# EAGLE design pc_heartypatch_v2.1 (EAGLE 6.6.0)

## Sheet 1 of 2
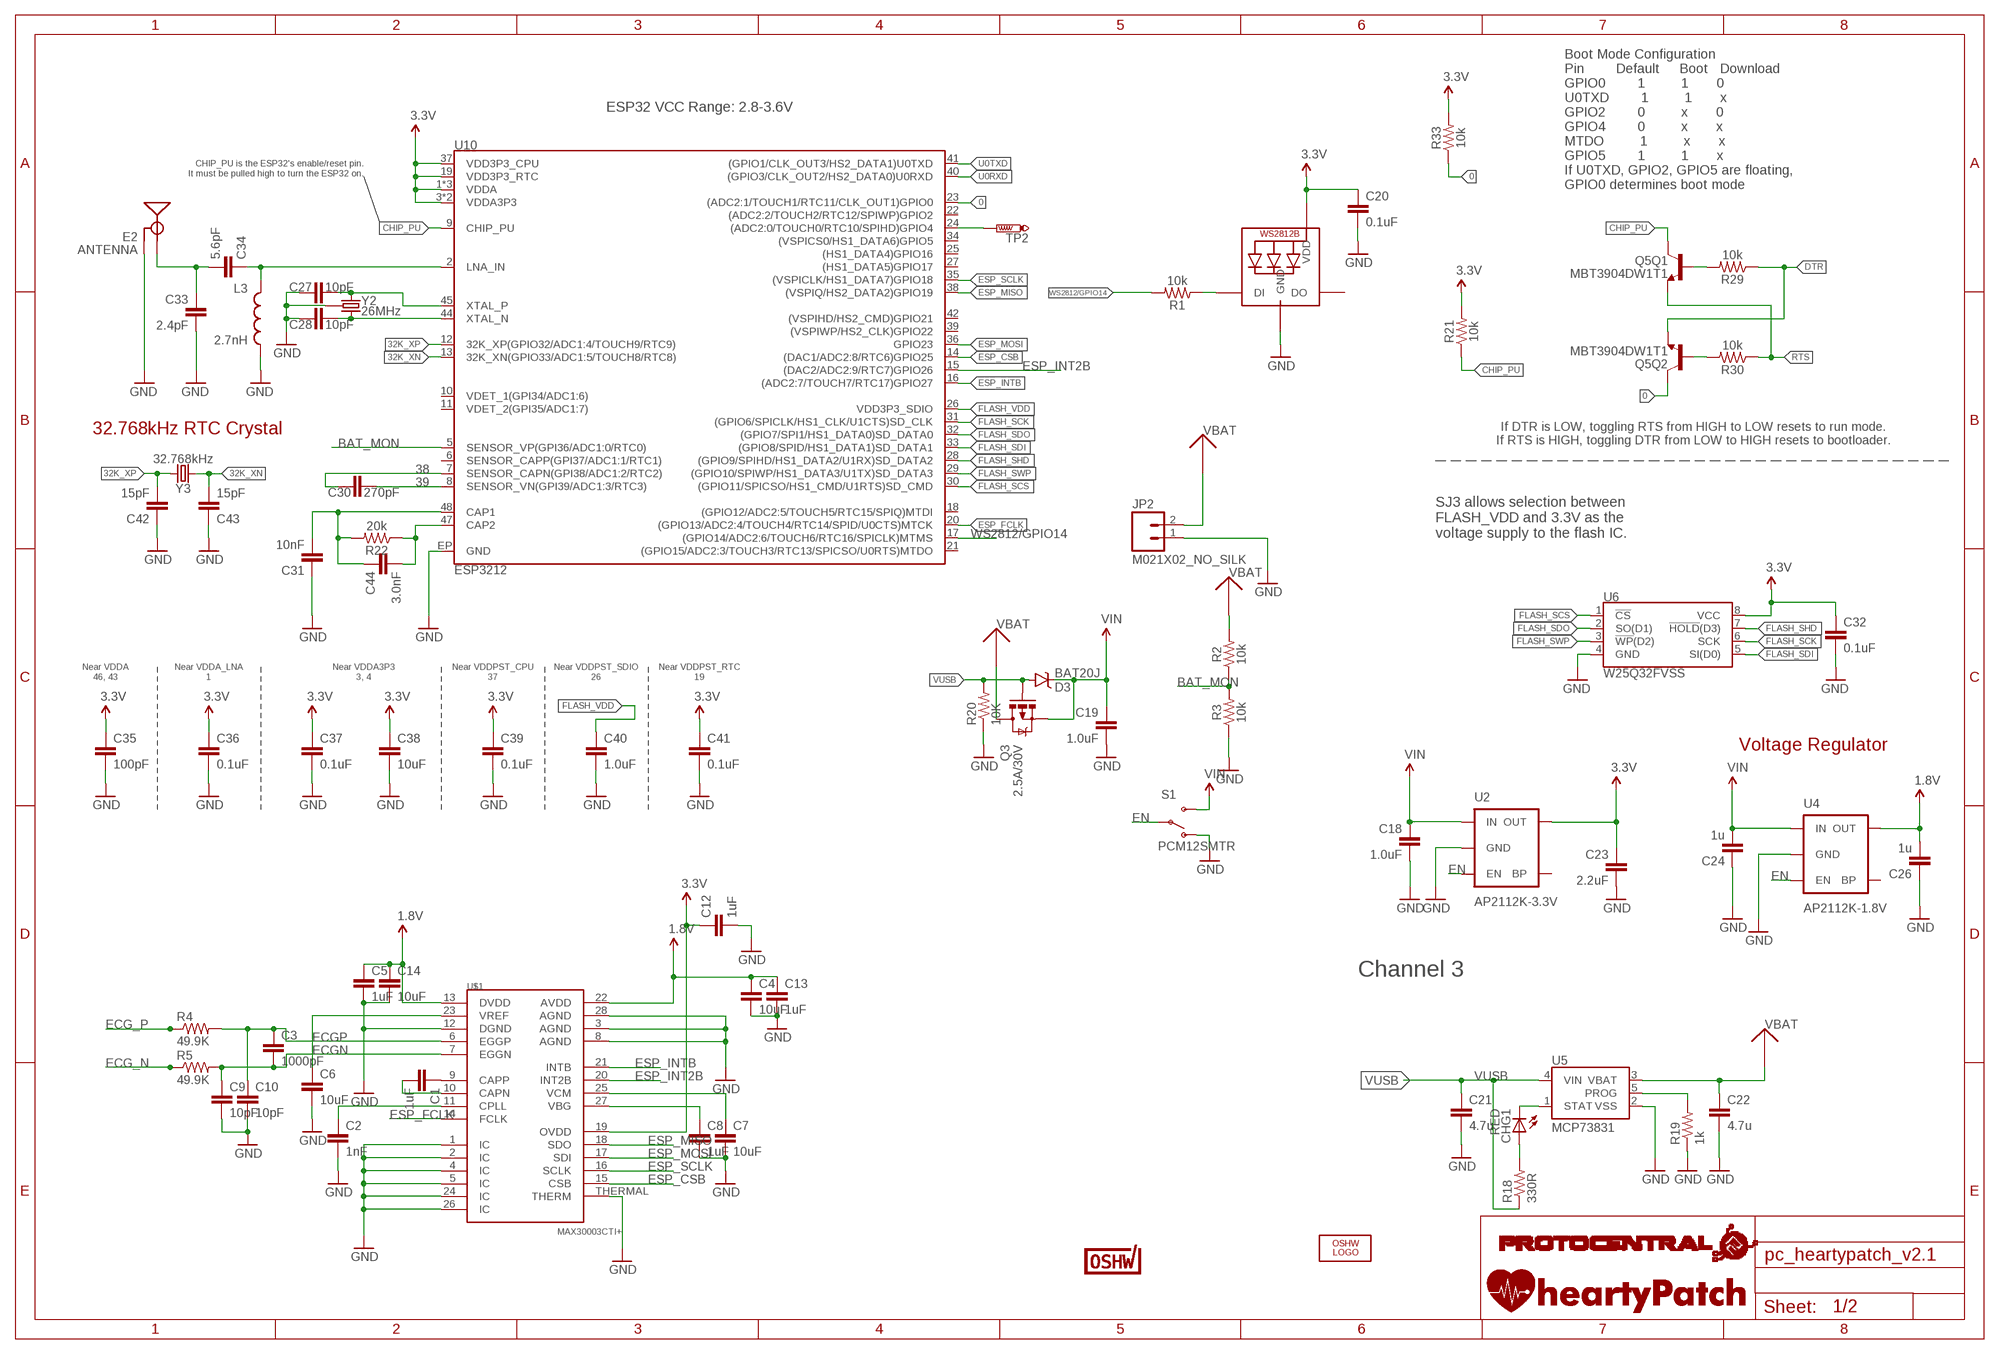
[diagram p0: schematic, sheet 1]

### Parts
C1  1uF  C-EUC0603  [C0603]
C2  1nF  C-EUC0603  [C0603]
C3  1000pF  C-EUC0402  [C0402]
C4  10uF  C-EUC0805  [C0805]
C5  1uF  C-EUC0402  [C0402]
C6  10uF  C-EUC0805  [C0805]
C7  10uF  C-EUC0805  [C0805]
C8  1uF  C-EUC0402  [C0402]
C9  10pF  C-EUC0402  [C0402]
C10  10pF  C-EUC0402  [C0402]
C12  1uF  C-EUC0402  [C0402]
C13  1uF  C-EUC0402  [C0402]
C14  10uF  C-EUC0603  [C0603]
C18  1.0uF  1.0UF-25V-+80/-20(0805)  [0805]
C19  1.0uF  C-EUC0402  [C0402]
C20  0.1uF  0.1UF-0603-25V-(+80/-20%)  [0603]
C21  4.7u  C-EUC0805  [C0805]
C22  4.7u  C-EUC0805  [C0805]
C23  2.2uF  C-EUC0805  [C0805]
C24  1u  C-EUC0805  [C0805]
C26  1u  C-EUC0805  [C0805]
C27  10pF  10PF-0603-50V-5%  [0603]
C28  10pF  10PF-0603-50V-5%  [0603]
C30  270pF  270PF-50V-5%(0603)  [0603]
C31  10nF  10NF-0603-50V-10%  [0603]
C32  0.1uF  0.1UF-0402-16V-10%  [0402]
C33  2.4pF  2.4PF-0603-50V-5%  [0603]
C34  5.6pF  5.6PF-50V-5%(0603)  [0603]
C35  100pF  100PF-0603-50V-5%  [0603]
C36  0.1uF  0.1UF-0603-25V-(+80/-20%)  [0603]
C37  0.1uF  0.1UF-0603-25V-(+80/-20%)  [0603]
C38  10uF  10UF-0603-6.3V-20%  [0603]
C39  0.1uF  0.1UF-0402-16V-10%  [0402]
C40  1.0uF  1.0UF-0603-16V-10%  [0603]
C41  0.1uF  0.1UF-0603-25V-(+80/-20%)  [0603]
C42  15pF  15PF-0603-50V-5%  [0603]
C43  15pF  15PF-0603-50V-5%  [0603]
C44  3.0nF  3.0NF-0603-50V-5%  [0603]
CHG1  RED  LEDCHIPLED_0603  [CHIPLED_0603]
D3  BAT20J  DIODE-SCHOTTKY-BAT20J  [SOD-323]
E2  ANTENNA  ANTENNATRACE-TUNED  [TRACE_ANTENNA_2.4GHZ_25.7MM_TUNED]
JP2  M021X02_NO_SILK  [1X02_NO_SILK]
L3  2.7nH  INDUCTOR0603  [0603]
LED1  WS2812B5050  [WS2812B]
LOGO1  OSHW_LOGO_FILLX0200-NT  [OSHW_FILLX200_NOTEXT]
Q3  2.5A/30V  MOSFET-PCHANNELDMG2307L  [SOT23-3]
Q5  MBT3904DW1T1  [SC70-6]
R1  10k  10KOHM-1/10W-1%(0603)0603  [0603]
R2  10k  10KOHM-1/10W-1%(0603)0603  [0603]
R3  10k  10KOHM-1/10W-1%(0603)0603  [0603]
R4  49.9K  RESISTOR0805-RES  [0805]
R5  49.9K  RESISTOR0805-RES  [0805]
R18  330R  R-US_R0402  [R0402]
R19  1k  R-US_R0402  [R0402]
R20  10K  R-US_R0402  [R0402]
R21  10k  10KOHM-1/10W-1%(0603)0603  [0603]
R22  20k  20KOHM-0603-1/10W-1%  [0603]
R29  10k  10KOHM-0603-1/10W-1%  [0603]
R30  10k  10KOHM-0603-1/10W-1%  [0603]
R33  10k  10KOHM-1/10W-1%(0603)0603  [0603]
S1  PCM12SMTR  SWITCH-SPDT-SMD-A  [SWITCH-SPST-SMD-A]
TP2  PTR1TP10SQ  [TP10SQ]
U2  AP2112K-3.3V  V_REG_LDOSMD  [SOT23-5]
U4  AP2112K-1.8V  V_REG_LDOSMD  [SOT23-5]
U5  MCP73831  [SOT23-5]
U6  W25Q32FVSS  [SOIC-8]
U10  ESP3212  [QFN48-0.4MM]
U$1  MAX30003CTI+  MAX30003  [QFN-28]
U$8  HEARTYPATCHHEART  [HEARTYPATCH]
U$9  PROTY_LOGO_WITH_TEXT  [PROTY_WITH_TEXT]
U$10  CERT-SMALL  [CERT-SMALL-SILK]
Y2  26MHz  CRYSTAL-GROUNDED3.2X2.5  [CRYSTAL-SMD-3.2X2.5]
Y3  32.768kHz  CRYSTAL-32.768KHZSMD-3.2X1.5  [CRYSTAL-SMD-3.2X1.5MM]

### Nets
0: Q5.6(Q2:C) R33.1 U10.23((ADC2:1/TOUCH1/RTC11/CLK_OUT1)GPIO0)
1.8V: C4.1 C5.1 C13.1 C14.1 C26.2 U4.5(OUT) U$1.13(DVDD) U$1.22(AVDD)
3.3V: C12.1 C20.1 C23.1 C32.1 C35.1 C36.1 C37.1 C38.1 C39.1 C41.1 LED1.1-VDD(VDD) R21.2 R33.2 U2.5(OUT) U6.8(VCC) U10.1(VDDA) U10.3(VDDA3P3) U10.4(VDDA3P3) U10.19(VDD3P3_RTC) U10.37(VDD3P3_CPU) U10.43(VDDA) U10.46(VDDA) U$1.19(OVDD)
32K_XN: C43.2 U10.13(32K_XN(GPIO33/ADC1:5/TOUCH8/RTC8)) Y3.P$2
32K_XP: C42.2 U10.12(32K_XP(GPIO32/ADC1:4/TOUCH9/RTC9)) Y3.P$1
38: C30.1 U10.7(SENSOR_CAPN(GPI38/ADC1:2/RTC2))
39: C30.2 U10.8(SENSOR_VN(GPI39/ADC1:3/RTC3))
BAT_MON: R2.1 R3.2 U10.5(SENSOR_VP(GPI36/ADC1:0/RTC0))
CAP_10N: C31.2 C44.1 R22.2 U10.48(CAP1)
CHIP_PU: Q5.3(Q1:C) R21.1 U10.9(CHIP_PU)
DTR: Q5.1(Q2:E) R29.1 ; also sheet 2
ECG_N: R5.1
ECG_P: R4.1
ECGN: C3.2 C9.1 R5.2 U$1.7(EGGN)
ECGP: C3.1 C10.1 R4.2 U$1.6(EGGP)
EN: S1.2(P) U2.3(EN) U4.3(EN)
ESP_CSB: U10.14((DAC1/ADC2:8/RTC6)GPIO25) U$1.15(CSB)
ESP_FCLK: U10.20((GPIO13/ADC2:4/TOUCH4/RTC14/SPID/U0CTS)MTCK) U$1.14(FCLK)
ESP_INT2B: U10.15((DAC2/ADC2:9/RTC7)GPIO26) U$1.20(INT2B)
ESP_INTB: U10.16((ADC2:7/TOUCH7/RTC17)GPIO27) U$1.21(INTB)
ESP_MISO: U10.38((VSPIQ/HS2_DATA2)GPIO19) U$1.18(SDO)
ESP_MOSI: U10.36(GPIO23) U$1.17(SDI)
ESP_SCLK: U10.35((VSPICLK/HS1_DATA7)GPIO18) U$1.16(SCLK)
FLASH_SCK: U6.6(SCK) U10.31((GPIO6/SPICLK/HS1_CLK/U1CTS)SD_CLK)
FLASH_SCS: U6.1(!CS!) U10.30((GPIO11/SPICSO/HS1_CMD/U1RTS)SD_CMD)
FLASH_SDI: U6.5(SI(D0)) U10.33((GPIO8/SPID/HS1_DATA1)SD_DATA1)
FLASH_SDO: U6.2(SO(D1)) U10.32((GPIO7/SPI1/HS1_DATA0)SD_DATA0)
FLASH_SHD: U6.7(!HOLD!(D3)) U10.28((GPIO9/SPIHD/HS1_DATA2/U1RX)SD_DATA2)
FLASH_SWP: U6.3(!WP!(D2)) U10.29((GPIO10/SPIWP/HS1_DATA3/U1TX)SD_DATA3)
FLASH_VDD: C40.1 U10.26(VDD3P3_SDIO)
GND: C2.2 C4.2 C5.2 C6.2 C7.2 C8.2 C9.2 C10.2 C12.2 C13.2 C14.2 C18.2 C19.2 C20.2 C21.2 C22.2 C23.2 C24.1 C26.1 C27.1 C28.1 C31.1 C32.2 C33.2 C35.2 C36.2 C37.2 C38.2 C39.2 C40.2 C41.2 C42.1 C43.1 E2.GND E2.GND2(GND) JP2.1 L3.2 LED1.3-GND(GND) R3.1 R19.1 R20.1 S1.1(O) U2.2(GND) U4.2(GND) U5.2(VSS) U6.4(GND) U10.EP(GND) U$1.1(IC) U$1.2(IC) U$1.3(AGND) U$1.4(IC) U$1.5(IC) U$1.8(AGND) U$1.12(DGND) U$1.24(IC) U$1.26(IC) U$1.28(AGND) U$1.THERMAL(THERM) Y2.2(GND) Y2.4(GND) ; also sheet 2
LNA_IN: C34.1 L3.1 U10.2(LNA_IN)
N$1: LED1.4-DIN(DI) R1.1
N$2: C6.1 U$1.23(VREF)
N$3: C1.1 U$1.9(CAPP)
N$4: TP2.TP U10.24((ADC2:0/TOUCH0/RTC10/SPIHD)GPIO4)
N$5: CHG1.C U5.1(STAT)
N$6: C1.2 U$1.10(CAPN)
N$7: C2.1 U$1.11(CPLL)
N$13: C7.1 U$1.25(VCM)
N$14: C8.1 U$1.27(VBG)
N$16: CHG1.A R18.2
N$19: R19.2 U5.5(PROG)
N$23: Q5.5(Q1:B) R29.2
N$24: Q5.2(Q2:B) R30.2
N$25: C27.2 U10.45(XTAL_P) Y2.1
N$26: C28.2 U10.44(XTAL_N) Y2.3
N$30: C44.2 R22.1 U10.47(CAP2)
RTS: Q5.4(Q1:E) R30.1 ; also sheet 2
TRACE_ANT1: C33.1 C34.2 E2.ANT(SIGNAL)
U0RXD: U10.40((GPIO3/CLK_OUT2/HS2_DATA0)U0RXD) ; also sheet 2
U0TXD: U10.41((GPIO1/CLK_OUT3/HS2_DATA1)U0TXD) ; also sheet 2
VBAT: C22.1 JP2.2 Q3.3(D) R2.2 U5.3(VBAT)
VIN: C18.1 C19.1 C24.2 D3.C Q3.2(S) S1.3(S) U2.1(IN) U4.1(IN)
VUSB: C21.1 D3.A Q3.1(G) R18.1 R20.2 U5.4(VIN) ; also sheet 2
WS2812/GPIO14: R1.2 U10.17((GPIO14/ADC2:6/TOUCH6/RTC16/SPICLK)MTMS)
Unconnected: LED1.2-DOUT(DO) U2.4(BP) U4.4(BP) U10.6(SENSOR_CAPP(GPI37/ADC1:1/RTC1)) U10.10(VDET_1(GPI34/ADC1:6)) U10.11(VDET_2(GPI35/ADC1:7)) U10.18((GPIO12/ADC2:5/TOUCH5/RTC15/SPIQ)MTDI) U10.21((GPIO15/ADC2:3/TOUCH3/RTC13/SPICSO/U0RTS)MTDO) U10.22((ADC2:2/TOUCH2/RTC12/SPIWP)GPIO2) U10.25((HS1_DATA4)GPIO16) U10.27((HS1_DATA5)GPIO17) U10.34((VSPICS0/HS1_DATA6)GPIO5) U10.39((VSPIWP/HS2_CLK)GPIO22) U10.42((VSPIHD/HS2_CMD)GPIO21)

### Notes on the sheet
- ESP32 VCC Range: 2.8-3.6V
- CHIP_PU is the ESP32's enable/reset pin.
  It must be pulled high to turn the ESP32 on.
- Boot Mode Configuration
  Pin        Default     Boot   Download
  GPIO0        1         1       0
  U0TXD        1         1       x
  GPIO2        0         x       0
  GPIO4        0         x       x
  MTDO         1         x       x
  GPIO5        1         1       x
  If U0TXD, GPIO2, GPIO5 are floating, 
  GPIO0 determines boot mode
- 32.768kHz RTC Crystal
- If DTR is LOW, toggling RTS from HIGH to LOW resets to run mode.
  If RTS is HIGH, toggling DTR from LOW to HIGH resets to bootloader.
- SJ3 allows selection between 
  FLASH_VDD and 3.3V as the
  voltage supply to the flash IC.
- Near VDDA
  46, 43
- Near VDDA_LNA
  1
- Near VDDA3P3
  3, 4
- Near VDDPST_CPU
  37
- Near VDDPST_SDIO
  26
- Near VDDPST_RTC
  19
- Voltage Regulator
- Channel 3

## Sheet 2 of 2
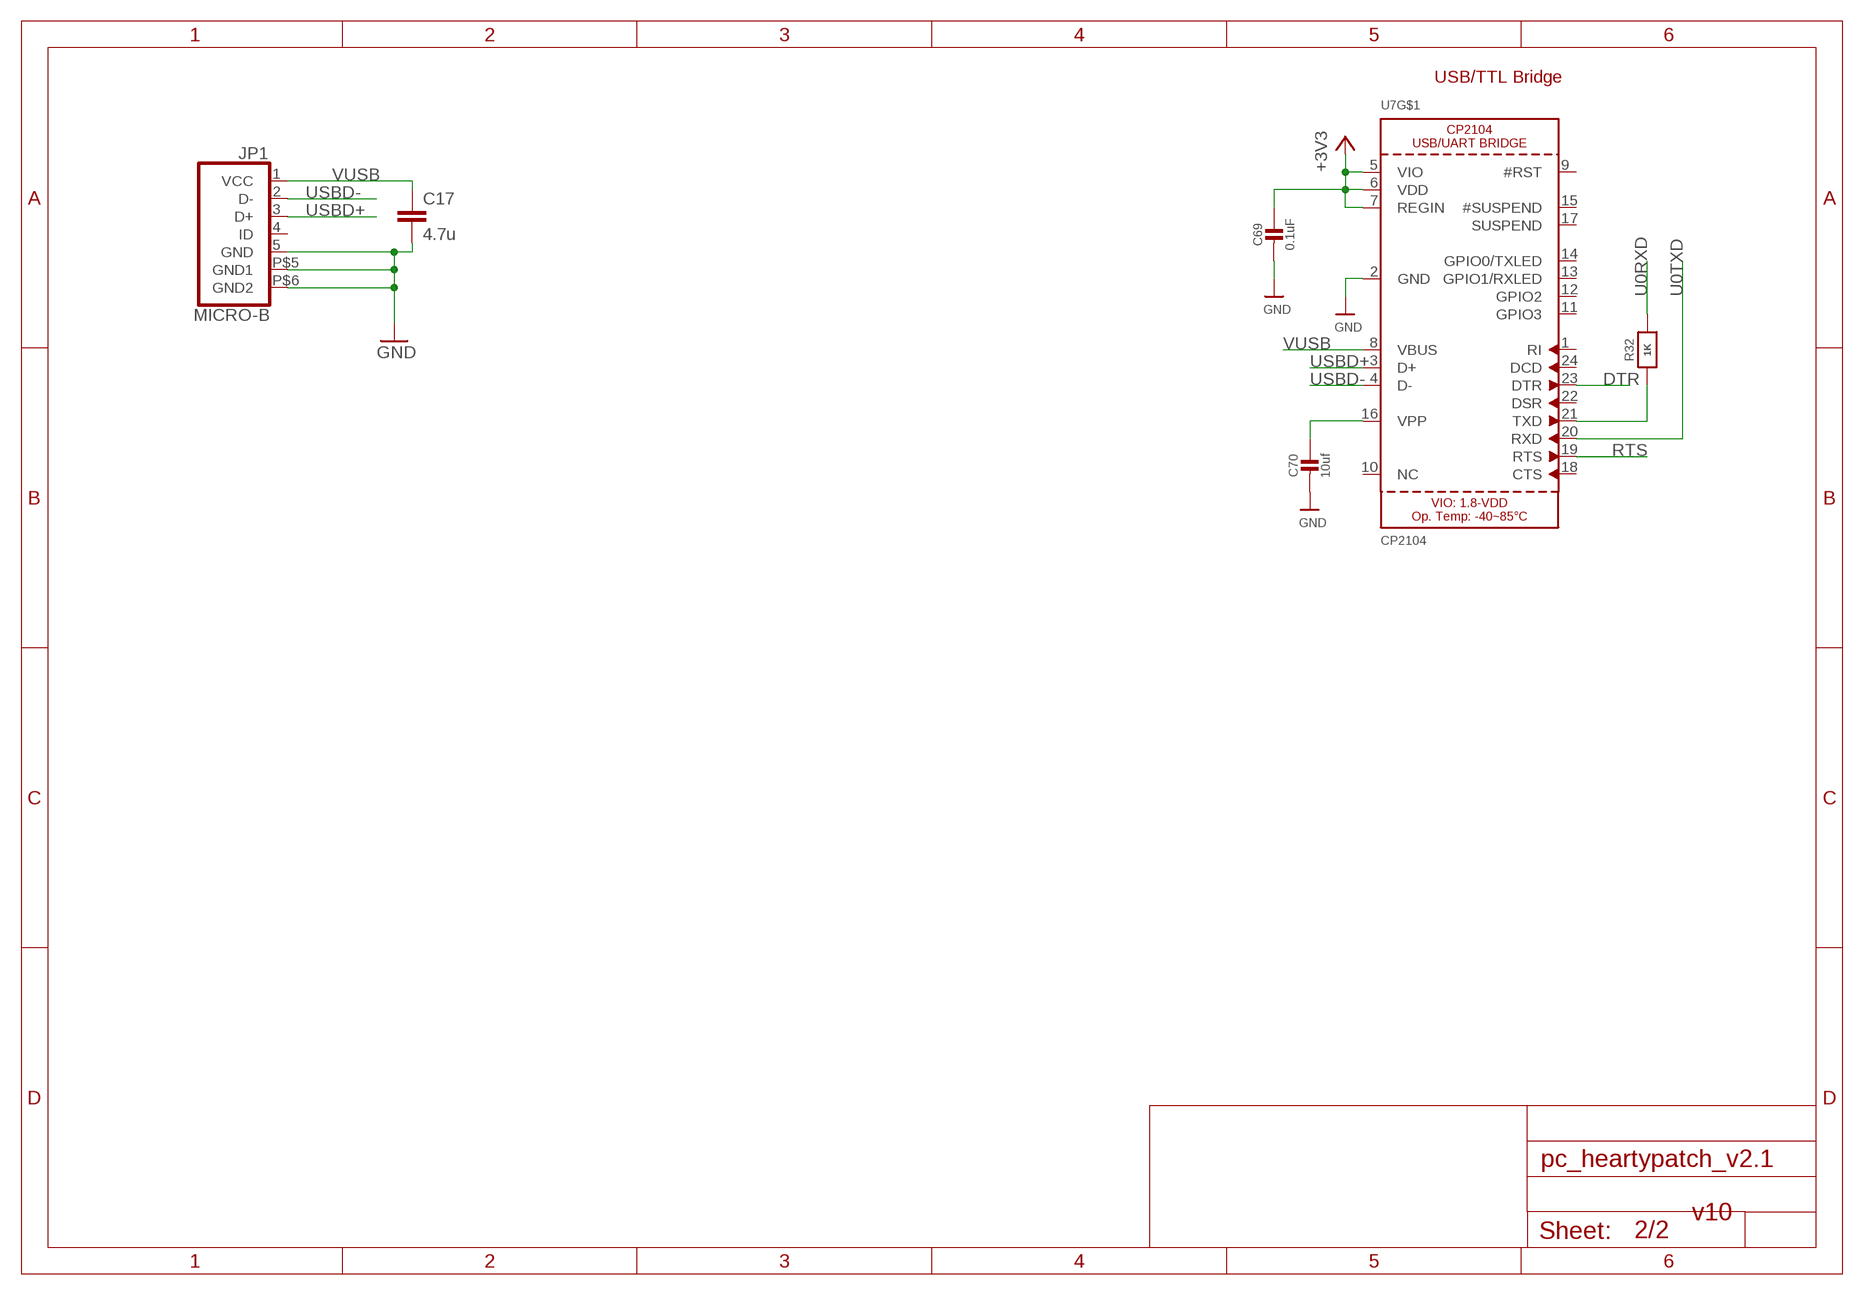
[diagram p1: schematic, sheet 2]

### Parts
C17  4.7u  C-EUC0805  [C0805]
C69  0.1uF  CAP_CERAMIC_0402  [_0402]
C70  10uf  CAP_CERAMIC0805-NOOUTLINE  [0805-NO]
JP1  MICRO-B  [MICRO-B]
R32  1K  RESISTOR_0603_NOOUT  [0603-NO]
U7  CP2104  [QFN24_4MM_SMSC]

### Nets
+3V3: C69.1 U7.5(VIO) U7.6(VDD) U7.7(REGIN)
DTR: U7.23(DTR) ; also sheet 1
GND: C17.2 C69.2 C70.2 JP1.5(GND) JP1.P$5(GND1) JP1.P$6(GND2) U7.2(GND) ; also sheet 1
N$27: R32.1 U7.21(TXD)
N$28: C70.1 U7.16(VPP)
RTS: U7.19(RTS) ; also sheet 1
U0RXD: R32.2 ; also sheet 1
U0TXD: U7.20(RXD) ; also sheet 1
USBD+: JP1.3(D+) U7.3(D+)
USBD-: JP1.2(D-) U7.4(D-)
VUSB: C17.1 JP1.1(VCC) U7.8(VBUS) ; also sheet 1
Unconnected: JP1.4(ID) U7.1(RI) U7.9(#RST) U7.10(NC) U7.11(GPIO3) U7.12(GPIO2) U7.13(GPIO1/RXLED) U7.14(GPIO0/TXLED) U7.15(#SUSPEND) U7.17(SUSPEND) U7.18(CTS) U7.22(DSR) U7.24(DCD)

### Notes on the sheet
- USB/TTL Bridge
- v10

## Power pins joined to a net without a drawn wire
TP: U7.THERM(TP)

## Library data of the parts
C1-C10 C12-C14 C17 C19 C21-C24 C26 = rcl:C-EU: CAPACITOR, European symbol
C18 = SparkFun-Capacitors:1.0UF-25V-+80/-20(0805): CAP-11625; PROD_ID: CAP-11625
C20 C36 C37 C41 = SparkFun-Capacitors:0.1UF: 0.1µF ceramic capacitors A capacitor is a passive two-terminal electrical component used to store electrical energy temporarily in an electric field.; PROD_ID: CAP-00810
C27 C28 = SparkFun-Capacitors:10PF: 10pF ceramic capacitors A capacitor is a passive two-terminal electrical component used to store electrical energy temporarily in an electric field.; PROD_ID: CAP-11812
C30 = esp32-thing-temp:270PF-50V-5%(0603): CAP-13339; PROD_ID: CAP-13339
C31 = SparkFun-Capacitors:10NF: 0.01uF/10nF/10,000pF ceramic capacitors A capacitor is a passive two-terminal electrical component used to store electrical energy temporarily in an electric field. CAP-09321; PROD_ID: CAP-00867
C32 C39 = SparkFun-Capacitors:0.1UF: 0.1µF ceramic capacitors A capacitor is a passive two-terminal electrical component used to store electrical energy temporarily in an electric field.; PROD_ID: CAP-12416
C33 = esp32-thing-temp:2.4PF: 2.4pF ceramic capacitors A capacitor is a passive two-terminal electrical component used to store electrical energy temporarily in an electric field.; PROD_ID: CAP-13541
C34 = esp32-thing-temp:5.6PF-50V-5%(0603): CAP-12456; PROD_ID: CAP-12456
C35 = SparkFun-Capacitors:100PF: 100pF/0.1nF ceramic capacitors A capacitor is a passive two-terminal electrical component used to store electrical energy temporarily in an electric field.; PROD_ID: CAP-07883
C38 = SparkFun-Capacitors:10UF: 10.0µF ceramic capacitors A capacitor is a passive two-terminal electrical component used to store electrical energy temporarily in an electric field.; PROD_ID: CAP-11015
C40 = SparkFun-Capacitors:1.0UF: 1µF ceramic capacitors A capacitor is a passive two-terminal electrical component used to store electrical energy temporarily in an electric field.; PROD_ID: CAP-00868
C42 C43 = SparkFun-Capacitors:15PF: 15pF ceramic capacitors A capacitor is a passive two-terminal electrical component used to store electrical energy temporarily in an electric field.; PROD_ID: CAP-07881
C44 = esp32-thing-temp:3.0NF: 3.0nF (3nF, 3000pF) ceramic capacitors A capacitor is a passive two-terminal electrical component used to store electrical energy temporarily in an electric field.; PROD_ID: CAP-13515
C69 C70 = microbuilder:CAP_CERAMIC: Ceramic Capacitors For new designs, use the packages preceded by an '_' character since they are more reliable: The following footprints should be used on most boards: _0402 - Standard footprint for regular board layouts _0603 - Standard footprint for regular board layouts _0805 - Standard footprint for regular board layouts _1206 - Standard footprint for regular board layouts For extremely tight-pitch boards where space is at a premium, the following 'micro-pitch' footprints can be used (smaller pads, no silkscreen outline, etc.): _0402MP - Micro-pitch footprint for very dense/compact boards _0603MP - Micro-pitch footprint for very dense/compact boards _0805MP - Micro-pitch footprint for very dense/compact boards _1206MP - Micro-pitch footprint for very dense/compact boards
CHG1 = led:LED: LED OSRAM: - CHIPLED LG R971, LG N971, LY N971, LG Q971, LY Q971, LO R971, LY R971 LH N974, LH R974 LS Q976, LO Q976, LY Q976 LO Q996 - Hyper CHIPLED LW Q18S LB Q993, LB Q99A, LB R99A - SideLED LS A670, LO A670, LY A670, LG A670, LP A670 LB A673, LV A673, LT A673, LW A673 LH A674 LY A675 LS A676, LA A676, LO A676, LY A676, LW A676 LS A679, LY A679, LG A679 - Hyper Micro SIDELED® LS Y876, LA Y876, LO Y876, LY Y876 LT Y87S - SmartLED LW L88C, LW L88S LB L89C, LB L89S, LG L890 LS L89K, LO L89K, LY L89K LS L896, LA L896, LO L896, LY L896 - TOPLED LS T670, LO T670, LY T670, LG T670, LP T670 LSG T670, LSP T670, LSY T670, LOP T670, LYG T670 LG T671, LOG T671, LSG T671 LB T673, LV T673, LT T673, LW T673 LH T674 LS T676, LA T676, LO T676, LY T676, LB T676, LH T676, LSB T676, LW T676 LB T67C, LV T67C, LT T67C, LS T67K, LO T67K, LY T67K, LW E67C LS E67B, LA E67B, LO E67B, LY E67B, LB E67C, LV E67C, LT E67C LW T67C LS T679, LY T679, LG T679 LS T770, LO T770, LY T770, LG T770, LP T770 LB T773, LV T773, LT T773, LW T773 LH T774 LS E675, LA E675, LY E675, LS T675 LS T776, LA T776, LO T776, LY T776, LB T776 LHGB T686 LT T68C, LB T68C - Hyper Mini TOPLED® LB M676 - Mini TOPLED Santana® LG M470 LS M47K, LO M47K, LY M47K Source: http://www.osram.convergy.de LUXEON: - LUMILED® LXK2-PW12-R00, LXK2-PW12-S00, LXK2-PW14-U00, LXK2-PW14-V00 LXK2-PM12-R00, LXK2-PM12-S00, LXK2-PM14-U00 LXK2-PE12-Q00, LXK2-PE12-R00, LXK2-PE12-S00, LXK2-PE14-T00, LXK2-PE14-U00 LXK2-PB12-K00, LXK2-PB12-L00, LXK2-PB12-M00, LXK2-PB14-N00, LXK2-PB14-P00, LXK2-PB14-Q00 LXK2-PR12-L00, LXK2-PR12-M00, LXK2-PR14-Q00, LXK2-PR14-R00 LXK2-PD12-Q00, LXK2-PD12-R00, LXK2-PD12-S00 LXK2-PH12-R00, LXK2-PH12-S00 LXK2-PL12-P00, LXK2-PL12-Q00, LXK2-PL12-R00 Source: www.luxeon.com KINGBRIGHT: KA-3528ASYC Source: www.kingbright.com
D3 = SparkFun-DiscreteSemi:DIODE-SCHOTTKY: Schottky diodes in SFE's production catalog BAT20J 1A 23V 0.62Vf RB751 120mA 40V 0.37Vf PMEG4005EJ 0.5A 40V 0.42Vf MBRA140 1A 40V 0.5Vf B340A 3A 40V SMA; PROD_ID: DIO-11623
E2 = esp32-thing-temp:ANTENNA: Chip antenna Chip antenna with ground or secondary connection. Common with larger metal RF connectors.
JP1 = circuitects:MICRO-B
JP2 = SparkFun-Connectors:M02: Standard 2-pin 0.1" header. Use with - straight break away headers ( PRT-00116) - right angle break away headers (PRT-00553) - swiss pins (PRT-00743) - machine pins (PRT-00117) - female headers (PRT-00115) Molex polarized connector foot print use with: PRT-08233 with associated crimp pins and housings. 2.54_SCREWTERM for use with PRT-10571. 3.5mm Screw Terminal footprints for PRT-08084 5mm Screw Terminal footprints for use with PRT-08433
L3 = SparkFun-Passives:INDUCTOR: Inductors Basic Inductor/Choke - 0603 and 1206. Footprints are not proven and vary greatly between part numbers. INDUCTOR POWER 3.3UH 4.0A SMD 0.197" L x 0.197" W x 0.177" H (5.00mm x 5.00mm x 4.50mm); PROD_ID: NDUC-08762
LED1 = adafruit:WS2812B
LOGO1 = ohw-logo:OSHW_LOGO_FILL
Q3 = SparkFun-DiscreteSemi:MOSFET-PCHANNEL: Generic PMOSFET IRLML2244 - TRANS-11153 (SOT-23 -20V -4.3A) (1.Gate 2.Source 3.Drain) FQP27P06 - COM-10349 <http://www.sparkfun.com/products/10349> (TO-220 -60V -27A) (1.Gate 2.Source 3.Drain); PROD_ID: TRANS-11308
Q5 = esp32-thing-temp:MBT3904DW1T1: MBT3904DW1 Dual NPN Transistors The MBT3904W1 puts two general purpose 3904 NPN transistors in a single package. Datasheet <http://www.onsemi.com/pub_link/Collateral/MBT3904DW1T1-D.PDF>; PROD_ID: TRANS-13337
R1-R3 R21 R33 = SparkFun-Resistors:10KOHM-1/10W-1%(0603): RES-00824; PROD_ID: RES-00824; VALUE: 10K
R4 R5 = SparkFun:RESISTOR: Resistor Basic schematic elements and footprints for 0603, 1206, and PTH resistors.
R18-R20 = rcl:R-US_: RESISTOR, American symbol
R22 = SparkFun-Resistors:20KOHM: 20kΩ resistor A resistor is a passive two-terminal electrical component that implements electrical resistance as a circuit element. Resistors act to reduce current flow, and, at the same time, act to lower voltage levels within circuits. - Wikipedia; PROD_ID: RES-09383
R29 R30 = SparkFun-Resistors:10KOHM: 10kΩ resistor A resistor is a passive two-terminal electrical component that implements electrical resistance as a circuit element. Resistors act to reduce current flow, and, at the same time, act to lower voltage levels within circuits. - Wikipedia; PROD_ID: RES-00824
R32 = microbuilder:RESISTOR: Resistors For new designs, use the packages preceded by an '_' character since they are more reliable: The following footprints should be used on most boards: _0402 - Standard footprint for regular board layouts _0603 - Standard footprint for regular board layouts _0805 - Standard footprint for regular board layouts _1206 - Standard footprint for regular board layouts For extremely tight-pitch boards where space is at a premium, the following 'micro-pitch' footprints can be used (smaller pads, no silkscreen outline, etc.): _0402MP - Micro-pitch footprint for very dense/compact boards _0603MP - Micro-pitch footprint for very dense/compact boards _0805MP - Micro-pitch footprint for very dense/compact boards _1206MP - Micro-pitch footprint for very dense/compact boards
S1 = SparkFun-Electromechanical:SWITCH-SPDT: SPDT Switch Simple slide switch, Spark Fun Electronics SKU : COM-00102 DPDT SMT slide switch, AYZ0202, SWCH-08179; PROD_ID: SWCH-10651
TP2 = testpad:PTR1: TEST PIN
U2 U4 = SparkFun-PowerIC:V_REG_LDO: Voltage Regulator LDO Standard 150mA LDO voltage regulator in SOT-23 layout. Micrel part MIC5205. BP (by-pass) pin is used to lower output noise with 470pF cap.; PROD_ID: VREG-12457
U5 = SparkFun:MCP73831: Microchip's MCP73831 Miniature single cell, fully integrated Li-Ion, Li-polymer charge management controller http://ww1.microchip.com/downloads/en/DeviceDoc/21984a.pdf
U6 = SparkFun-DigitalIC:W25Q32FV: Winbond W25Q32FV 32Mbit (4MB) Flash The W25Q32FV support the standard Serial Peripheral Interface (SPI), Dual/Quad I/O SPI as well as 2-clocks instruction cycle Quad Peripheral Interface (QPI). Datasheet <http://www.winbond.com/resource-files/w25q32fv%20revh%20091613.pdf>; PROD_ID: IC-13229
U7 = microbuilder:CP2104: CP2104 - USB to UART Bridge VDD Output: 3.45V
U10 = esp32-thing-temp:ESP3212; PROD_ID: IC-13338
U$1 = circuitects:MAX30003
U$8 = circuitects:HEARTYPATCH
U$9 = circuitects:PROTY_LOGO_WITH_TEXT
U$10 = OSHWA:CERT
Y2 = things:CRYSTAL-GROUNDED; PROD_ID: XTAL-12454
Y3 = SparkFun-Clocks:CRYSTAL-32.768KHZ: 32.768kHz Crystal Frequency: 32.768kHz Frequency Stability: ±20ppm Load Capacitance: 12.5pF (PTH-2X6 & SMD-3.2X1.5), 6pF (SMD-2X6); PROD_ID: XTAL-13062

## Net classes
2 gnd: width 0.254 mm, drill 0.254 mm, clearance 0.178 mm

## Board
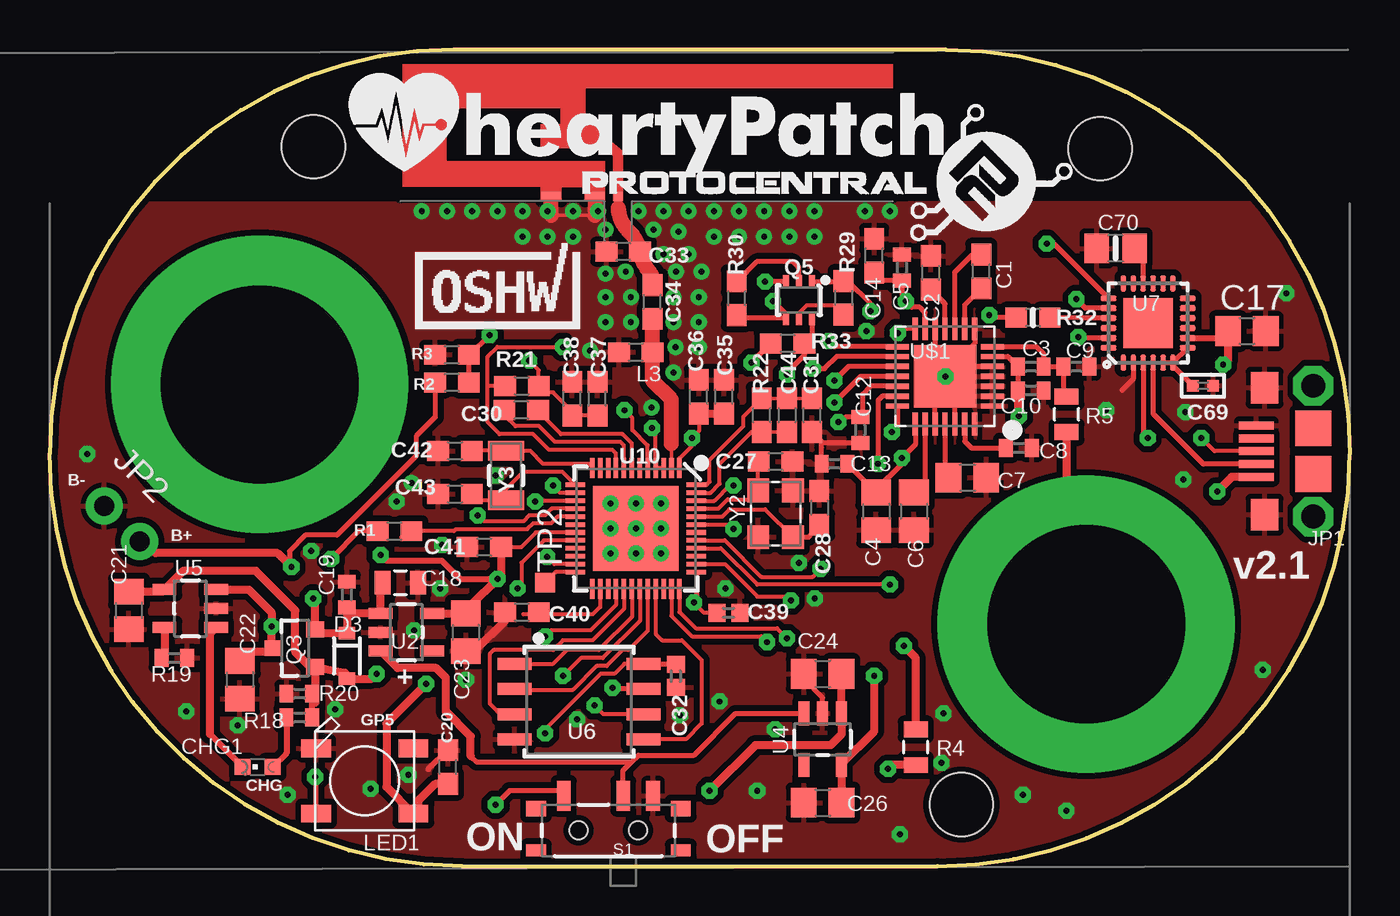
[diagram p2: board, top side]
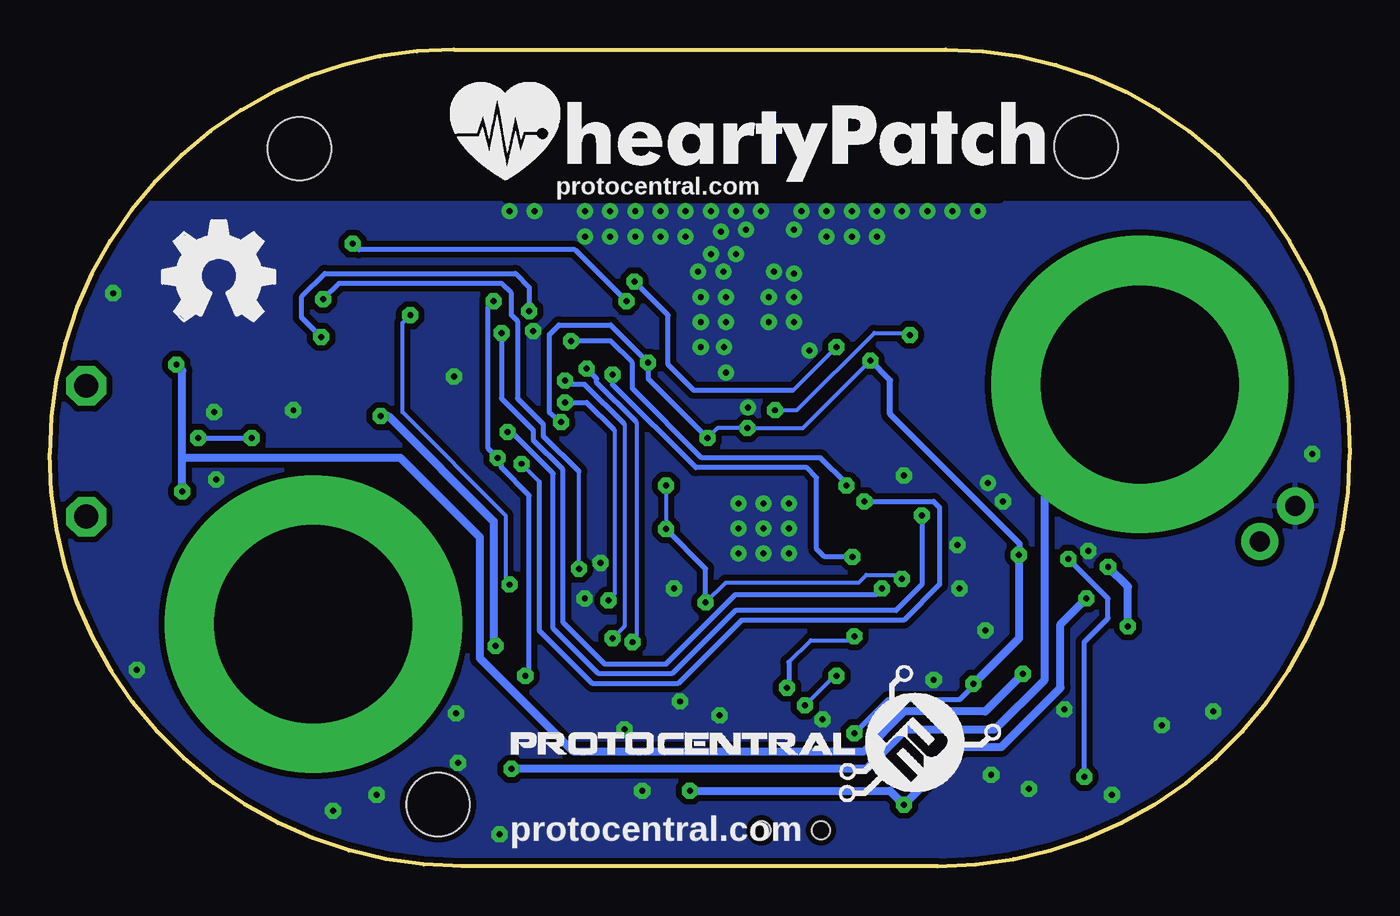
[diagram p3: board, bottom side, seen from below]

Size 65.6 x 41.2 mm. Coordinates in mm from the lower left corner, seen from the top.
Outline: 45.2,41.2 20.4,41.2 arc90 0,20.8 arc90 20.8,0 44.8,0 arc90 65.6,20.8 arc90 45.2,41.2
Copper layers (1*2*15*16): Top 0.035mm / dielectric 1.5mm / Route2 0.035mm / dielectric 0.15mm / Route15 0.035mm / dielectric 0.2mm / Bottom 0.035mm
Design rules "Circuitects-Rules": minimum track width 6mil, minimum drill 0.3mm, track to track 6mil, track to pad 6mil, pad to pad 6mil, via to via 6mil, smd to smd 6mil, copper to edge 10mil, drill to drill 8mil, minimum pad ring 12mil, minimum via ring 10mil, stop-mask expansion 4mil, vias tented up to drill 25mil, thermal gap 10mil
Holes 3.2 mm at 46,3.1 13.3,36.3 53,36.2

### Footprints (pad centres in the part's own frame; a part is rotated, then mirrored left to right if it is on the bottom)
C0603 = smd 1.1 x 1: 1 -0.85,0; 2 0.85,0
C0402 = smd 0.7 x 0.9: 1 -0.65,0; 2 0.65,0
C0805 = smd 1.3 x 1.5: 1 -0.95,0; 2 0.95,0
0805 = smd 0.8 x 1.2: 1 -0.9,0; 2 0.9,0
0603 = smd 1.1 x 1: 1 -0.85,0; 2 0.85,0
0402 = smd 0.85 x 0.9: 1 -0.58,0; 2 0.58,0
_0402 = smd 0.6 x 0.6: 1 -0.508,0; 2 0.508,0
0805-NO = smd 1.24 x 1.5: 1 -0.95,0; 2 0.95,0
CHIPLED_0603 = smd 0.8 x 0.8: A 0,-0.75; C 0,0.75
SOD-323 = smd 0.63 x 0.83: A 1.15,0; C -1.15,0
TRACE_ANTENNA_2.4GHZ_25.7MM_TUNED = smd 0.46 x 0.46: ANT 0,0.23 | smd 1 x 0.46: GND -1.18,0.23; GND2 -3.38,0.23
MICRO-B = smd 0.4 x 1.75: 1 -1.25,2.975; 2 -0.6,2.975; 3 0.05,2.975; 4 0.7,2.975; 5 1.35,2.975 | smd 1.8 x 1.8: P$1 -1.1,0.1; P$2 1.2,0.1 | drill 1.2 pad 2 octagon: P$3 -3.25,0.1; P$4 3.35,0.1 | smd 1.6 x 1.4: P$5 -3.15,2.55; P$6 3.25,2.55
1X02_NO_SILK = drill 1.016 pad 1.88: 1 0,0; 2 2.54,0
WS2812B = smd 1.5 x 0.9: 1-VDD 2.45,-1.65; 2-DOUT 2.45,1.65; 3-GND -2.45,1.65; 4-DIN -2.45,-1.65
SOT23-3 = smd 0.8 x 0.9: 1 -0.95,-1; 2 0.95,-1; 3 0,1.1
SC70-6 = smd 0.3 x 0.66: 1 -0.65,-0.92; 2 0,-0.92; 3 0.65,-0.92; 4 0.65,0.92; 5 0,0.92; 6 -0.65,0.92
R0402 = smd 0.7 x 0.9: 1 -0.65,0; 2 0.65,0
0603-NO = smd 1.075 x 1: 1 -0.85,0; 2 0.85,0
SWITCH-SPST-SMD-A = smd 0.7 x 1.5: 1 -2.25,-1.75; 2 -0.75,-1.75; 3 2.25,-1.75 | smd 1 x 0.6: GND1 -3.65,1; GND3 3.65,1 | smd 1 x 0.8: GND2 -3.65,-1.1; GND4 3.65,-1.1 | hole 0.9: -1.5,0; 1.5,0
TP10SQ = smd 1 x 1: TP 0,0
SOT23-5 = smd 0.55 x 1.2: 1 -0.95,-1.3; 2 0,-1.3; 3 0.95,-1.3; 4 0.95,1.3; 5 -0.95,1.3
SOIC-8 = smd 0.61 x 1.702: 1 -1.905,-3.251; 2 -0.635,-3.251; 3 0.635,-3.251; 4 1.905,-3.251; 5 1.905,3.251; 6 0.635,3.251; 7 -0.635,3.251; 8 -1.905,3.251
QFN24_4MM_SMSC = smd 0.8 x 0.28: 1 -2,1.25; 2 -2,0.75; 3 -2,0.25; 4 -2,-0.25; 5 -2,-0.75; 6 -2,-1.25; 13 2,-1.25; 14 2,-0.75; 15 2,-0.25; 16 2,0.25; 17 2,0.75; 18 2,1.25 | smd 0.28 x 0.8: 7 -1.25,-2; 8 -0.75,-2; 9 -0.25,-2; 10 0.25,-2; 11 0.75,-2; 12 1.25,-2; 19 1.25,2; 20 0.75,2; 21 0.25,2; 22 -0.25,2; 23 -0.75,2; 24 -1.25,2 | smd 2.5 x 2.5: THERM 0,0
QFN48-0.4MM = smd 1 x 0.23: 1 -3.05,2.2; 2 -3.05,1.8; 3 -3.05,1.4; 4 -3.05,1; 5 -3.05,0.6; 6 -3.05,0.2; 7 -3.05,-0.2; 8 -3.05,-0.6; 9 -3.05,-1; 10 -3.05,-1.4; 11 -3.05,-1.8; 12 -3.05,-2.2; 25 3.05,-2.2; 26 3.05,-1.8; 27 3.05,-1.4; 28 3.05,-1; 29 3.05,-0.6; 30 3.05,-0.2; 31 3.05,0.2; 32 3.05,0.6; 33 3.05,1; 34 3.05,1.4; 35 3.05,1.8; 36 3.05,2.2 | smd 0.23 x 1: 13 -2.2,-3.05; 14 -1.8,-3.05; 15 -1.4,-3.05; 16 -1,-3.05; 17 -0.6,-3.05; 18 -0.2,-3.05; 19 0.2,-3.05; 20 0.6,-3.05; 21 1,-3.05; 22 1.4,-3.05; 23 1.8,-3.05; 24 2.2,-3.05; 37 2.2,3.05; 38 1.8,3.05; 39 1.4,3.05; 40 1,3.05; 41 0.6,3.05; 42 0.2,3.05; 43 -0.2,3.05; 44 -0.6,3.05; 45 -1,3.05; 46 -1.4,3.05; 47 -1.8,3.05; 48 -2.2,3.05 | smd 4.3 x 4.3: EP 0,0
QFN-28 = smd 1.15 x 0.27: 1 -2.4,1.5; 2 -2.4,1; 3 -2.4,0.5; 4 -2.4,0; 5 -2.4,-0.5; 6 -2.4,-1; 7 -2.4,-1.5; 15 2.4,-1.5; 16 2.4,-1; 17 2.4,-0.5; 18 2.4,0; 19 2.4,0.5; 20 2.4,1; 21 2.4,1.5 | smd 0.27 x 1.15: 8 -1.5,-2.4; 9 -1,-2.4; 10 -0.5,-2.4; 11 0,-2.4; 12 0.5,-2.4; 13 1,-2.4; 14 1.5,-2.4; 22 1.5,2.4; 23 1,2.4; 24 0.5,2.4; 25 0,2.4; 26 -0.5,2.4; 27 -1,2.4; 28 -1.5,2.4 | smd 3.15 x 3.15: THERMAL 0,0
CRYSTAL-SMD-3.2X2.5 = smd 1.2 x 1.1: 1 -1.175,-0.875; 2 1.175,-0.875; 3 1.175,0.875; 4 -1.175,0.875
CRYSTAL-SMD-3.2X1.5MM = smd 1 x 1.8: P$1 -1.25,0; P$2 1.25,0

### Placement (x,y rotation side)
C1  47,30 90 top
C2  44.46,29.94 90 top
C3  49.5,25.2 0 top
C4  41.7,17.9 270 top
C5  43,30.2 90 top
C6  43.6,17.9 270 top
C7  46.3,19.6 0 top
C8  48.9,21.1 0 top
C9  51.8,25.2 0 top
C10  49.5,24 0 top
C12  40.9,22 270 top
C13  39.6,20.3 180 top
C14  41.6,30.8 90 top
C17  60.4,27 0 top
C18  17.7,14.3 0 top
C19  15,13.7 90 top
C20  20.1,5 90 top
C21  4,12.9 270 top
C22  9.6,9.4 270 top
C23  21,11.8 270 top
C24  39,9.7 0 top
C26  39,3.2 0 top
C27  36.62,20.41 180 top
C28  38.83,18.07 270 top
C30  23.79,23.01 180 top
C31  38.47,22.75 90 top
C32  31.6,9.59 270 top
C33  28.94,31 180 top
C34  30.41,28.46 90 top
C35  34.02,23.68 90 top
C36  32.75,23.68 90 top
C37  27.64,23.59 90 top
C38  26.37,23.59 90 top
C39  34.24,12.78 0 top
C40  23.83,12.81 180 top
C41  21.93,16.1 180 top
C42  20.45,20.95 0 top
C43  20.45,18.77 0 top
C44  37.2,22.75 270 top
C69  58.19,24.24 0 top
C70  53.78,31.16 180 top
CHG1  10.5,5 90 top
D3  15,10.6 270 top
E2  28.69,33.55 0 top
JP1  63.85,20.88 90 top
JP2  2.75,18.17 315 top
L3  29.58,25.93 180 top
LED1  15.9,4.3 0 top
LOGO1  59.9,27.5 0 bottom
Q3  12.4,11 90 top
Q5  37.8,28.56 180 top
R1  17.4,16.9 0 top
R2  20.3,24.4 180 top
R3  20.3,25.8 0 top
R4  43.7,6 90 top
R5  51.3,22.8 90 top
R18  12.6,7.5 180 top
R19  6.3,10.5 180 top
R20  12.6,8.7 0 top
R21  23.83,24.22 0 top
R22  35.93,22.75 90 top
R29  40.05,28.67 270 top
R30  34.67,28.65 90 top
R32  49.61,27.67 180 top
R33  37.23,26.37 180 top
S1  28.19,1.8 180 top
TP2  25,14.3 0 top
U2  18,11.8 270 top
U4  39,6.4 180 top
U5  7.1,13 90 top
U6  26.71,8.3 270 top
U7  55.42,27.4 90 top
U10  29.58,17.04 270 top
U$1  45.17,24.71 180 top
U$4  HEARTYPATCHHEART  [HEARTYPATCH]  45.4,34.55 0 bottom
U$7  PROTY_LOGO_WITH_TEXT  [PROTY_WITH_TEXT]  26.9,31.9 0 top
U$8  15.1,35 0 top
U$9  42.3,3.6 0 bottom
U$10  22.6,27.1 0 top
U$35  PROTY-LOGO  [LOGO-PROTY]  80.63,6.6 0 top  (outside the outline)
Y2  36.62,17.77 270 top
Y3  23.02,19.71 270 top

### Tracks (layer width: path | path; a pad name or v marks a point on that pad's centre or on a via)
0  (via drill 0.3)
  Top 0.2: U10.23 25.47,15.23 v25.1,15.6 | R33.1 38.45,26.4
  Top 0.254: v37.2,24.8 37.3,25 38.08,25.78 R33.1 38.45,26.74 Q5.6
  Bottom 0.254: v25.1,15.6 26.5,15.6 26.9,16 26.9,19.6 27.4,20.1 33,20.1 37.2,24.3 v37.2,24.8
1.8V  (via drill 0.3)
  Top 0.254: U$1.13 44.17,27.93 43.9,28.2 43.5,28.2 v43.2,28.5 43,28.7 C5.1 42,29.55 C14.1 | 41.7,18.9 41.65,18.9 | U$1.22 43.67,21.27 v43,20.6 43,20.3 41.7,19 41.7,18.9 | C4.1 C13.1 | 41.65,18.8 C4.1 | 41.7,18.9 C4.1
  Top 0.406: v41.6,9.6 41.6,6.8 39.95,5.15 U4.5 C26.2
  Bottom 0.254: v43,20.6 43.3,20.9 | v43.2,28.5 43.5,28.2 43.5,21.1 v43,20.6 | v43,20.6 42.8,20.4 42.8,20.1 41.4,18.7 41.4,9.8 v41.6,9.6
3.3V  (via drill 0.3)
  Top 0.2: U10.1 31.77,20.57 32.4,21.2 v32.4,21.6 32.75,21.95 C36.1 | U10.3 U10.4 30.58,21.93 v30.4,22.1 | 22.88,16.2 C41.1 23.8,16.1 24.54,16.84 U10.19 | 32.52,13.32 v32.5,13.3 33.02,12.78 C39.1 | U10.46 33.54,18.43 34.3,19.2 v34.5,19.2 | U10.43 34.27,17.23 v34.5,17 | C37.1 C38.1 26.37,22.93 25.4,23.9 25,23.9 R21.2 24.68,25.02 v24.2,25.5 | U6.8 29.01,10.21 28.5,9.7 27.8,9.7 25,6.9
  Top 0.254: U$1.19 41.41,24.21 41,23.8 41,22.75 C12.1 40.15,22.65 v39.8,22.4 | R33.2 v35.4,25.4 | U6.8 31.57,10.21 C32.1 | 25,6.9 v25,6.7 | U10.37 32.62,13.42 v32.5,13.3
  Top 0.305: v22.6,14.5 20.7,14.5 19.8,15.4 17,15.4 v16.7,15.7
  Top 0.406: C36.1 C35.1 | C41.1 22.77,14.67 v22.6,14.5 21.3,13.2 C23.1 21.15,12.9 20.8,12.9 20.65,12.75 U2.5 | C20.1 19.45,4.15 18.6,3.3 18.6,2.9 LED1.1-VDD 17,4 17,7.2 v19,9.2
  Bottom 0.2: v32.4,21.6 31.9,22.1 v30.4,22.1 27.6,22.1 v24.2,25.5 | v22.6,14.5 22.8,14.7 24.4,14.7 24.8,14.3 31.5,14.3 v32.5,13.3 | v34.5,19.2 v34.5,17
  Bottom 0.254: v19,9.2 19,9.1 19.7,8.4 23.3,8.4 v25,6.7 | v32.5,13.3 32.5,15 v34.5,17 | v32.4,21.6 35.4,24.6 v35.4,25.4 37.3,27.3 39.9,27.3 40.4,26.8 40.4,22.9 v39.8,22.4
  Bottom 0.305: v24.2,25.5 23.2,24.5 23.2,22.8 16.67,16.27 16.67,15.73 v16.7,15.7
  Bottom 0.406: v16.7,15.7 16.7,11.5 v19,9.2
32K_XN
  Top 0.2: C43.2 21.62,18.46 Y3.P$2 23.02,19.02 23.9,19.9 25.86,19.9 U10.13
32K_XP
  Top 0.2: C42.2 21.62,20.96 Y3.P$1 24.24,20.96 24.9,20.3 27.2,20.3 27.38,20.12 U10.12
38
  Top 0.2: U10.7 29.38,21.32 28.9,21.8 25.8,21.8 24.64,22.96 C30.1 24.74,22.76
39
  Top 0.2: U10.8 28.98,21.22 28.8,21.4 25.5,21.4 24.7,22.2 23.5,22.2 23.04,22.66 C30.2
+3V3
  Top 0.254: U7.7 U7.6 | U7.5 U7.6 | U7.6 56.67,25.25 C69.1
BAT_MON  (via drill 0.3)
  Top 0.2: U10.5 30.18,21.22 29.4,22 29.4,22.6 v29,23
  Top 0.254: v22.2,26.8 21.2,25.8 R3.2 R2.1
  Bottom 0.2: v29,23 27.9,23 24,26.9 22.3,26.9 v22.2,26.8
CAP_10N
  Top 0.178: C31.2 C44.1 R22.2
  Top 0.2: R22.2 35,22.68 35,22.2 33.3,20.5 33.3,19.4 33.13,19.23 U10.48
CHIP_PU  (via drill 0.3)
  Top 0.2: U10.9 28.58,20.82 28.4,21 25.2,21 24.4,21.8 22.7,21.8 22.1,22.4 22.1,24.2 | 22.1,24.2 22.1,25.7 22.6,26.2 v25.9,26.2 | R21.1 22.12,24.22 22.1,24.2 | Q5.3 37.15,29.25
  Top 0.254: Q5.3 36.28,29.48 v36.1,29.5
  Bottom 0.2: 28.1,24 v25.9,26.2
  Bottom 0.254: 28.1,24 33.1,24 34.4,25.3 34.4,27.8 v36.1,29.5
DTR  (via drill 0.3)
  Top 0.254: Q5.1 40.01,29.48 R29.1 40.28,29.52 41.4,28.4 v41.4,28 | U7.23 51.95,26.65 v51.9,26.7
  Bottom 0.254: v51.9,26.7 52.9,27.7 52.9,28.7 51.7,29.9 42.1,29.9 41.4,29.2 v41.4,28
ECG_N  (via drill 10 pad 15)
  Top 0.406: R5.1 51.3,13.2 v52.3,12.2
ECG_P  (via drill 0.3, 10 pad 15)
  Top 0.406: R4.1 42.5,5.1 v42.3,4.9
  Bottom 0.406: v10.6,24.3 15.4,19.5 15.4,9.4 17.9,6.9 22.4,6.9 24.4,4.9 v42.3,4.9
ECGN
  Top 0.254: U$1.7 49.79,26.21 50.15,25.85 C3.2 C9.1 51.15,23.85 R5.2
ECGP  (via drill 0.3)
  Top 0.254: U$1.6 48.34,25.71 C3.1 C10.1
  Top 0.406: R4.2 43.7,10.5 v43.1,11.1 | C10.1 48.85,22.75 v48.9,22.7
  Bottom 0.406: v48.9,22.7 48.5,22.7 43.2,17.4 43.2,11.2 v43.1,11.1
EN
  Top 0.254: S1.2 28.94,4.84 29.35,5.25 | 29.35,5.25 29.7,5.6 32.5,5.6 34.6,7.7 U4.3 | 21.25,5.55 21.55,5.25 29.35,5.25
  Top 0.406: U2.3 17.55,10 19.5,10 20,9.5 20,7.8 21.25,6.55 21.25,5.55
ESP_CSB  (via drill 0.3)
  Top 0.2: U10.14 25.77,18.84 v25.4,19.2
  Top 0.254: U$1.15 39.59,26.21 v39.3,26.5
  Bottom 0.254: v25.4,19.2 25.4,19.3 26.7,20.6 32.7,20.6 36.2,24.1 36.2,25.4 37.3,26.5 v39.3,26.5
ESP_FCLK  (via drill 0.3)
  Top 0.2: U10.20 24.94,16.43 23.8,15.3 23.8,14.2 v23.6,14
  Top 0.254: U$1.14 43.01,27.11 v42.8,26.9
  Bottom 0.254: v42.8,26.9 42.8,23.6 41.2,22 41.2,21.5 39.7,20 39.7,12.3 37.6,10.2 34.5,10.2 31,13.7 23.9,13.7 v23.6,14
ESP_INT2B  (via drill 0.3)
  Top 0.2: U10.15 24.54,18.43 v24.5,18.4
  Top 0.254: U$1.20 42.01,23.71 41.8,23.5 v41.8,20.3
  Bottom 0.2: 40.9,19.4 v41.8,20.3
  Bottom 0.254: 40.9,19.4 40.9,11.9 38.2,9.2 33.9,9.2 30.7,12.4 22.5,12.4 20.7,14.2 20.7,18.1 21,18.4 v24.5,18.4
ESP_INTB  (via drill 0.3)
  Top 0.2: U10.16 25.34,18.04 25,17.7 24.2,17.7 23.9,17.4 21.9,17.4 v21.6,17.7
  Top 0.254: U$1.21 42.77,22.17 v42.5,21.9
  Bottom 0.254: v42.5,21.9 42.3,21.9 40.2,19.8 40.2,12 37.9,9.7 34.2,9.7 31,12.9 22.9,12.9 21.6,14.2 v21.6,17.7
ESP_MISO  (via drill 0.3)
  Top 0.2: U10.38 34.07,15.23 35.7,13.6 37.2,13.6 v37.4,13.4
  Top 0.254: U$1.18 40.91,24.71 v39.6,23.4
  Bottom 0.2: 37.1,22 37.1,13.7 v37.4,13.4
  Bottom 0.254: 37.1,22 38.5,23.4 v39.6,23.4
ESP_MOSI  (via drill 0.3)
  Top 0.2: U10.36 31.77,12.82 32.6,12 36.7,12 v37.2,11.5
  Top 0.254: U$1.17 40.31,25.21 v39.6,24.5
  Bottom 0.2: 36.6,22.3 36.6,12.1 v37.2,11.5
  Bottom 0.254: 36.6,22.3 38.6,24.3 39.4,24.3 v39.6,24.5
ESP_SCLK  (via drill 0.3)
  Top 0.2: U10.35 31.38,12.62 32.4,11.6 35.9,11.6 v36.2,11.3
  Top 0.254: U$1.16 39.71,25.71 39.1,25.1 v38.5,25.1
  Bottom 0.2: 36,22.4 36,11.5 v36.2,11.3
  Bottom 0.254: 36,22.4 38,24.4 38,24.6 v38.5,25.1
FLASH_SCK  (via drill 0.3)
  Top 0.2: U10.31 29.77,12.38 27.9,10.5 26.8,10.5 v25.9,9.6 | U6.6 27.94,7.67 v27.5,8.1
  Bottom 0.2: v25.9,9.6 26,9.6 v27.5,8.1
FLASH_SCS
  Top 0.2: U10.30 29.38,12.57 27.7,10.9 26.1,10.9 25.41,10.21 U6.1
FLASH_SDI
  Top 0.2: U10.33 30.58,11.72 30.9,11.4 31.9,11.4 32.9,10.4 32.9,7.2 32.1,6.4 U6.5
FLASH_SDO
  Top 0.2: U10.32 30.18,11.88 29.2,10.9 28.9,10.9 28.1,10.1 27.6,10.1 26.4,8.9 23.49,8.9 U6.2
FLASH_SHD  (via drill 0.3)
  Top 0.2: U10.28 28.58,13.17 27.3,11.9 25.3,11.9 v25,11.6
  Top 0.254: U6.7 28.47,8.93 v28.4,9
  Bottom 0.2: 28.3,10.3 27.2,11.4 25.2,11.4 v25,11.6
  Bottom 0.254: 28.3,10.3 28.3,9.1 v28.4,9
FLASH_SWP
  Top 0.2: U10.29 28.98,12.97 27.4,11.4 25.9,11.4 25.4,10.9 22.4,10.9 22.2,10.7 22.2,8.2 22.6,7.8 23.32,7.8 U6.3
FLASH_VDD
  Top 0.2: U10.26 27.77,13.07 27.4,12.7 23.89,12.7 C40.1
GND  (via drill 0.3)
  Top 0.178: 27.51,32.83 25.31,32.83
  Top 0.254: U7.2 54.67,24.57 54.1,24 | U$1.12 44.67,25.21 U$1.THERMAL | U$1.8 46.67,26.37 46.2,25.9 46.2,25.74 U$1.THERMAL | U$1.5 45.67,25.21 U$1.THERMAL | U$1.24 44.67,24.21 U$1.THERMAL | U$1.26 45.67,24.21 U$1.THERMAL | C13.2 38.95,21.41 | 38.95,21.41 C31.1 | C12.2 39.02,21.35 38.95,21.41 | U4.2 39,8.5 38.05,9.45 C24.1
  Top 0.305: C20.2 20.05,5.85 19.1,4.9
  Top 0.406: C40.2 22.98,12.38 21.45,10.85 C23.2
  Top 0.762: E2.GND 27.51,32.83 | 25.31,32.83 E2.GND2
  other vias: 61.2,9.91 28.3,17.04 28.3,18.3 29.58,18.3 30.84,17.04 30.84,15.76 29.58,15.76 28.3,15.76 25.13,33.04 23.86,33.04 22.59,33.04 21.32,33.04 20.05,33.04 18.78,33.04 26.4,33.04 27.67,33.04 29.7,33.04 30.97,33.04 32.24,33.04 33.51,33.04 34.78,33.04 36.05,33.04 37.32,33.04 38.59,33.04 41.13,33.04 42.4,33.04 28.05,32.12 30.46,32.12 29.07,29.99 31.61,29.99 30.97,30.88 29.32,28.72 31.48,28.72 29.32,27.45 31.48,27.45 31.58,26.18 31.48,24.91 30.36,23.14 28.05,28.72 28.05,27.45 28.05,29.89 26.4,31.77 25.13,31.77 23.86,31.77 31.73,32.02 32.24,30.88 32.88,29.99 32.75,28.72 32.75,27.45 32.75,26.18 33.51,31.77 34.78,31.77 36.05,31.77 37.32,31.77 38.59,31.77 29.58,17.04 18.26,19.33 27.27,26.02 18.1,4.6 38.6,13.5 57.2,19.5 49.1,3.6 53.3,23 33.8,8.3 18.4,11.9 17.5,18.4 19.8,16.2 45.1,7.7 26.6,7.4 6.9,7.8 12,3.6 16.2,3.9 42.9,1.6 45,5.2 35.7,3.8 30.84,18.3 22.5,19.7 9.5,7.1 19.7,14 14.4,7.9 41.2,27 62.4,28.9 36.6,6.9 57.3,22.9 31.8,7.6 37.8,15.3 34.1,14 45.2,24.7 51.3,2.8 21,9.4 1.9,20.8 13.2,15.9
  pour Bottom (isolate 0.305, rank 6): 65.6,0 0,0.1 0,33.43 65.6,33.43
  pour Top (isolate 0.305, rank 6): 0,0.1 65.6,0 65.6,33.43 43.73,33.43 43.7,33.4 43.6,33.4 43.58,33.43 43.33,33.43 43.3,33.4 0,33.43
LNA_IN
  Top 0.178: L3.1 30.41,25.94 | U10.2 31.38,21.31
  Top 0.762: L3.1 30.43,24.48 31.38,23.53 31.38,21.31 | 30.41,25.94 C34.1
N$1  (via drill 0.3)
  Top 0.254: LED1.4-DIN 13.45,4.45 v13.4,4.5 | R1.1 15.6,16.9 v14.2,15.5
  Bottom 0.254: v13.4,4.5 13.4,11.3 12.2,12.5 12.2,13.5 v14.2,15.5
N$2
  Top 0.254: U$1.23 44.17,19.42 C6.1
N$3
  Top 0.254: U$1.9 46.17,28.32 C1.1
N$4
  Top 0.2: U10.24 25.54,14.83 TP2.TP
N$5
  Top 0.305: 8.1,6.65 CHG1.C
  Top 0.406: 8.1,6.65 8.1,11.75 U5.1
N$6
  Top 0.254: U$1.10 45.67,29.97 46.55,30.85 C1.2
N$7
  Top 0.254: U$1.11 45.17,28.38 C2.1
N$13
  Top 0.254: U$1.25 45.17,19.78 C7.1
N$14
  Top 0.254: U$1.27 46.17,21.43 46.5,21.1 C8.1
N$16
  Top 0.305: R18.2 11.95,5.7 CHG1.A
N$19
  Top 0.406: U5.5 5.8,10.65 R19.2
N$23
  Top 0.2: Q5.5 37.8,27.9 38.2,28.3 39.57,28.3 R29.2
N$24
  Top 0.254: Q5.2 37.8,30.2 37.5,30.5 35.67,30.5 R30.2
N$25
  Top 0.2: U10.45 33.73,18.04 34.2,18.5 35.3,18.5 Y2.1 35.75,20.38 C27.2
N$26
  Top 0.2: U10.44 33.94,17.63 34.3,18 36.09,18 Y2.3
  Top 0.254: Y2.3 38.3,16.59 C28.2
N$27
  Top 0.254: U7.21 52.09,27.65 R32.1
N$28
  Top 0.254: U7.16 55.17,30.73 C70.1
N$30
  Top 0.178: R22.1 C44.2
  Top 0.2: U10.47 33.34,18.84 33.8,19.3 33.8,20.3 35.4,21.9 R22.1
RTS  (via drill 0.3)
  Top 0.254: R30.1 34.83,27.64 Q5.4 37.15,27.85 v36.5,28.5 | 53.25,28.65 U7.19 50.67,31.4 v50.3,31.4
  Bottom 0.254: v36.5,28.5 39.1,31.1 50,31.1 v50.3,31.4
TRACE_ANT1
  Top 0.178: E2.ANT 28.69,33.22
  Top 0.762: 28.69,33.22 arc46 29.22,32.05 arc-35 C33.1 arc33 30.26,29.99 arc-37 30.39,29.68 30.39,29.34 C34.2
U0RXD  (via drill 0.3)
  Top 0.2: v42.4,14.2 35.7,14.2 33.87,16.04 U10.40
  Top 0.254: R32.2 47.53,27.67 v47.4,27.8
  Bottom 0.2: v47.4,27.8 47.8,27.4 47.8,22.9 42.6,17.7 42.6,14.4 v42.4,14.2
U0TXD  (via drill 0.3)
  Top 0.2: v38.9,15 38.5,14.6 35.9,14.6 34.07,16.43 U10.41
  Top 0.254: U7.20 52.25,28.15 v51.8,28.6
  Bottom 0.2: v38.9,15 38.9,19.9
  Bottom 0.254: v51.8,28.6 51,29.4 42.8,29.4 42.3,28.9 42.3,27.8 42,27.5 42,23.6 40.7,22.3 40.7,21.7 38.9,19.9
USBD+  (via drill 0.3)
  Top 0.2: JP1.3 58.77,20.93 v58.1,21.6
  Top 0.254: U7.3 55.17,21.83 v55.4,21.6
  Bottom 0.254: v58.1,21.6 v55.4,21.6
USBD-
  Top 0.254: U7.4 55.67,22.83 58.21,20.29 JP1.2
VBAT  (via drill 0.3)
  Top 0.254: R2.2 19.45,22.65 18.5,21.7 18.5,20.7 14.5,16.7 12.9,16.7 12.1,15.9 12.1,15.2 v12.2,15.1
  Top 0.406: U5.3 10.05,13.95 11.2,12.8 v11.2,12.1 11.2,10.8 | 11.2,10.8 Q3.3 | v12.2,15.1 11.5,15.8 5.34,15.8 JP2.2 | 11.2,10.8 10.05,10.8 C22.1
  Bottom 0.406: v11.2,12.1 11.2,14.1 v12.2,15.1
VIN  (via drill 0.3)
  Top 0.254: S1.3 25.69,3.8 23.2,3.8 v22.5,3.1
  Top 0.406: v13.3,13.5 13.4,13.4 Q3.2 13.5,11.75 D3.C C19.1 15.3,12.75 U2.1 16.7,14.2 C18.1 | C24.2 U4.1 39.95,6.65 39.4,6.1 35.6,6.1 v33.3,3.8
  Bottom 0.406: v13.3,13.5 14.6,12.2 14.6,9 17.6,6 19.6,6 v22.5,3.1 23.2,3.8 v33.3,3.8
VUSB  (via drill 0.3)
  Top 0.305: R18.1 R20.2 | U7.8 59.1,26.65 C17.1
  Top 0.406: Q3.1 14.9,9.75 D3.A 16.25,9.45 v16.5,9.7 | Q3.1 13.4,8.25 R20.2 | Q3.1 13.4,9.8 12.4,10.8 12.4,12.9 10.4,14.9 6.75,14.9 U5.4 5.7,13.85 C21.1 | JP1.1 59.63,19.63 v58.9,18.9 | 59.25,25.35 v59.2,25.3 59.45,25.55 C17.1
  Bottom 0.406: v16.5,9.7 18.4,7.8 22.5,7.8 24.5,5.8 39.2,5.8 43.9,10.5 43.9,16.6 47.9,20.6 58.8,20.6 58.9,20.5 | v58.9,18.9 58.9,20.5 | 58.9,20.5 58.9,25 v59.2,25.3
WS2812/GPIO14
  Top 0.2: U10.17 25.63,17.63 25.3,17.3 24.4,17.3 24.1,17 20.5,17 20.4,16.9 R1.2 17.75,16.6

### Text on the board
tPlace: B- | B+ | v2.1 | R19 | + | GP5 | CHG | ON | OFF
bPlace: protocentral.com | protocentral.com